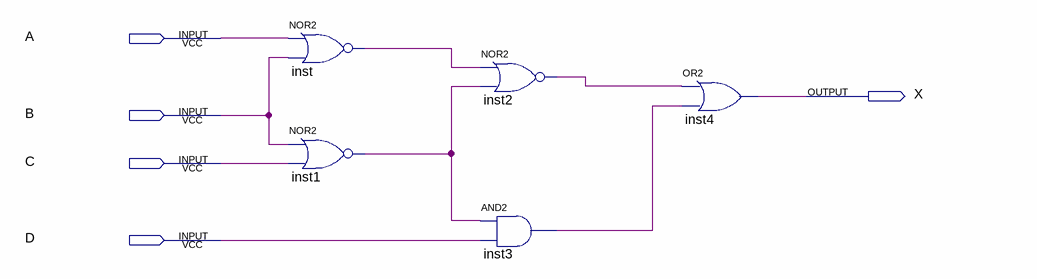
[diagram p0: schematic sheet]
// Quartus schematic prob5-39.bdf as structural Verilog: 5 symbols, 5 pins
module \prob5-39  (
  input  A,
  input  B,
  input  C,
  input  D,
  output X
);

  wire inst1_out, inst2_out, inst3_out, inst_out;

  nor inst (inst_out, A, B);
  nor inst1 (inst1_out, B, C);
  nor inst2 (inst2_out, inst_out, inst1_out);
  and inst3 (inst3_out, inst1_out, D);
  or inst4 (X, inst2_out, inst3_out);
endmodule
